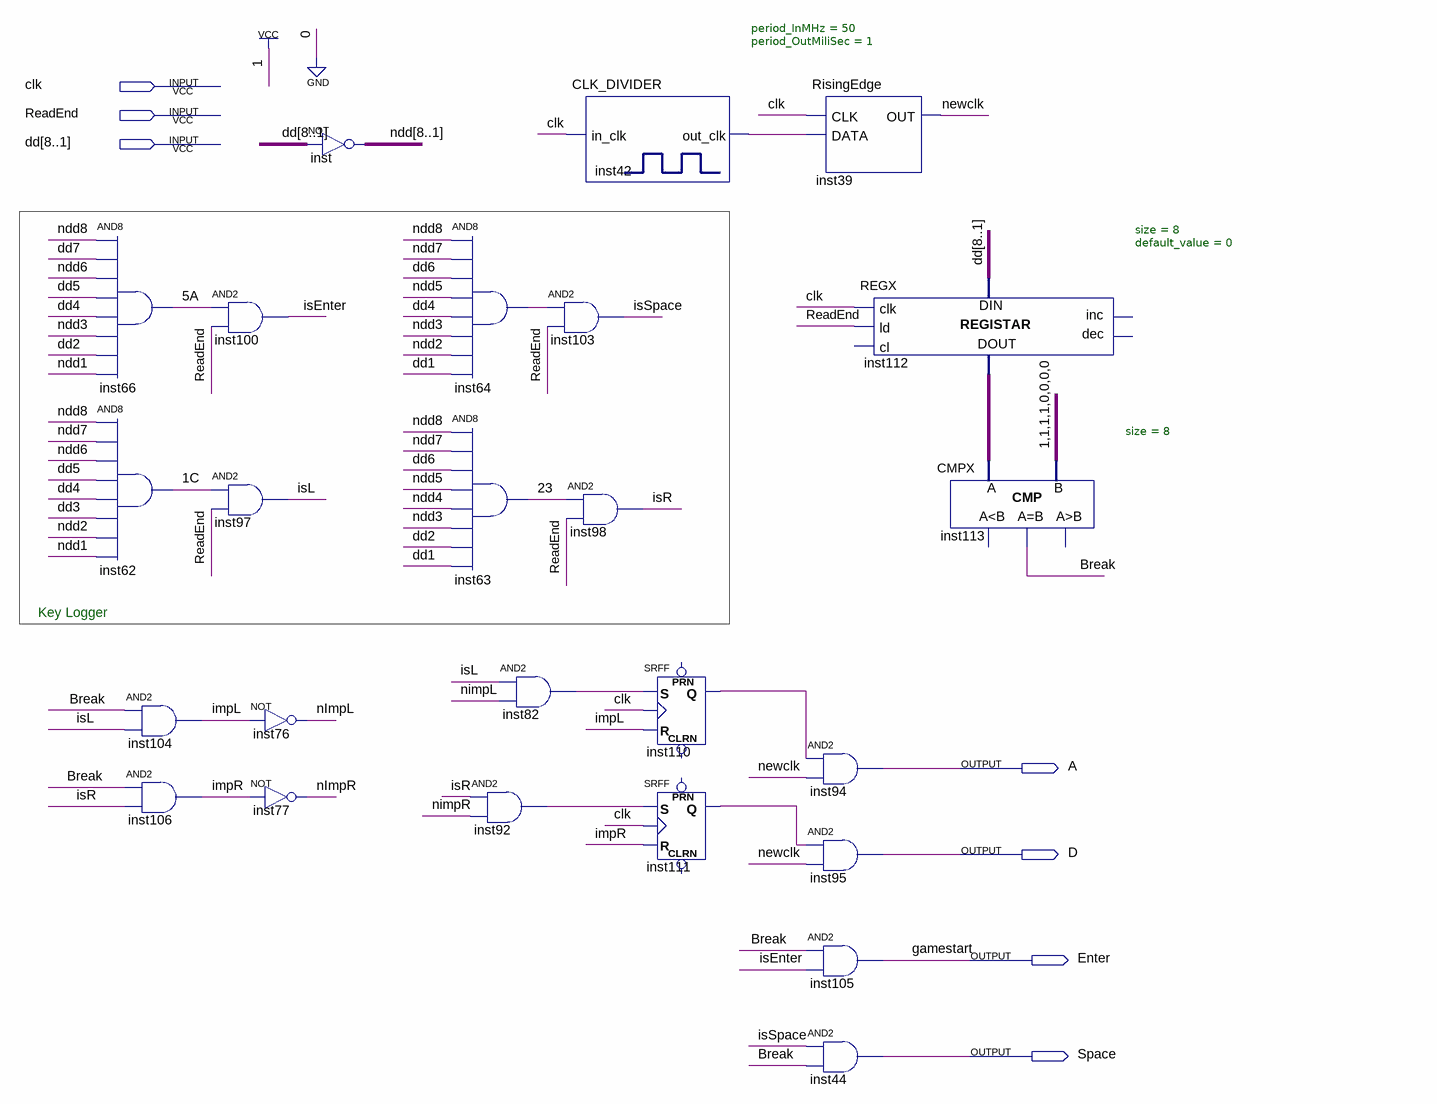
[diagram p0: schematic sheet]
// Quartus schematic KeyMngr.bdf as structural Verilog: 25 symbols, 7 pins
module KeyMngr (
  input  clk,
  input  ReadEnd,
  input  [8:1] dd,
  output A,
  output D,
  output Enter,
  output Space
);

  wire \1C , \5A , \23 , Break, impL, impR, inst42_out_clk, inst64_out, inst82_out, inst92_out, inst110_q,
       inst111_q, isEnter, isL, isR, isSpace, newclk, nImpL, nImpR;
  wire [7:0] inst112_data_out;
  wire [8:1] ndd;

  and inst66 (\5A , ndd[8], dd[7], ndd[6], dd[5], dd[4], ndd[3], dd[2], ndd[1]);
  and inst62 (\1C , ndd[8], ndd[7], ndd[6], dd[5], dd[4], dd[3], ndd[2], ndd[1]);
  and inst104 (impL, Break, isL);
  and inst106 (impR, Break, isR);
  and inst100 (isEnter, \5A , ReadEnd);
  and inst97 (isL, \1C , ReadEnd);
  not inst76 (nImpL, impL);
  not inst77 (nImpR, impR);
  assign ndd = ~dd;  // NOT inst, 8 bits wide
  and inst64 (inst64_out, ndd[8], ndd[7], dd[6], ndd[5], dd[4], ndd[3], ndd[2], dd[1]);
  and inst63 (\23 , ndd[8], ndd[7], dd[6], ndd[5], ndd[4], ndd[3], dd[2], dd[1]);
  and inst82 (inst82_out, isL, nImpL);
  and inst92 (inst92_out, isR, nImpR);
  CLK_DIVIDER #(.period_InMHz(50), .period_OutMiliSec(1)) inst42 (.in_clk(clk), .out_clk(inst42_out_clk));
  and inst103 (isSpace, inst64_out, ReadEnd);
  and inst98 (isR, \23 , ReadEnd);
  SRFF inst110 (.S(inst82_out), .R(impL), .CLK(clk), .Q(inst110_q));  // open: PRN, CLRN
  SRFF inst111 (.S(inst92_out), .R(impR), .CLK(clk), .Q(inst111_q));  // open: PRN, CLRN
  RisingEdge inst39 (.CLK(clk), .DATA(inst42_out_clk), .OUT(newclk));
  and inst94 (A, inst110_q, newclk);
  and inst95 (D, inst111_q, newclk);
  and inst105 (Enter, Break, isEnter);
  and inst44 (Space, isSpace, Break);
  REGX #(.size(8), .default_value(0)) inst112 (
    .clk(clk), .ld(ReadEnd), .data_in(dd), .data_out(inst112_data_out));  // open: cl, inc, dec
  CMPX #(.size(8)) inst113 (.A(inst112_data_out), .B(8'b11110000), .eq(Break));  // open: ls, gr

  // Other names for the same wires on the sheet: gamestart = Enter

  // Notes on the sheet:
  //   Key Logger
endmodule
